# EAGLE design PulsePal_3_0_1 (EAGLE 9.7.0)
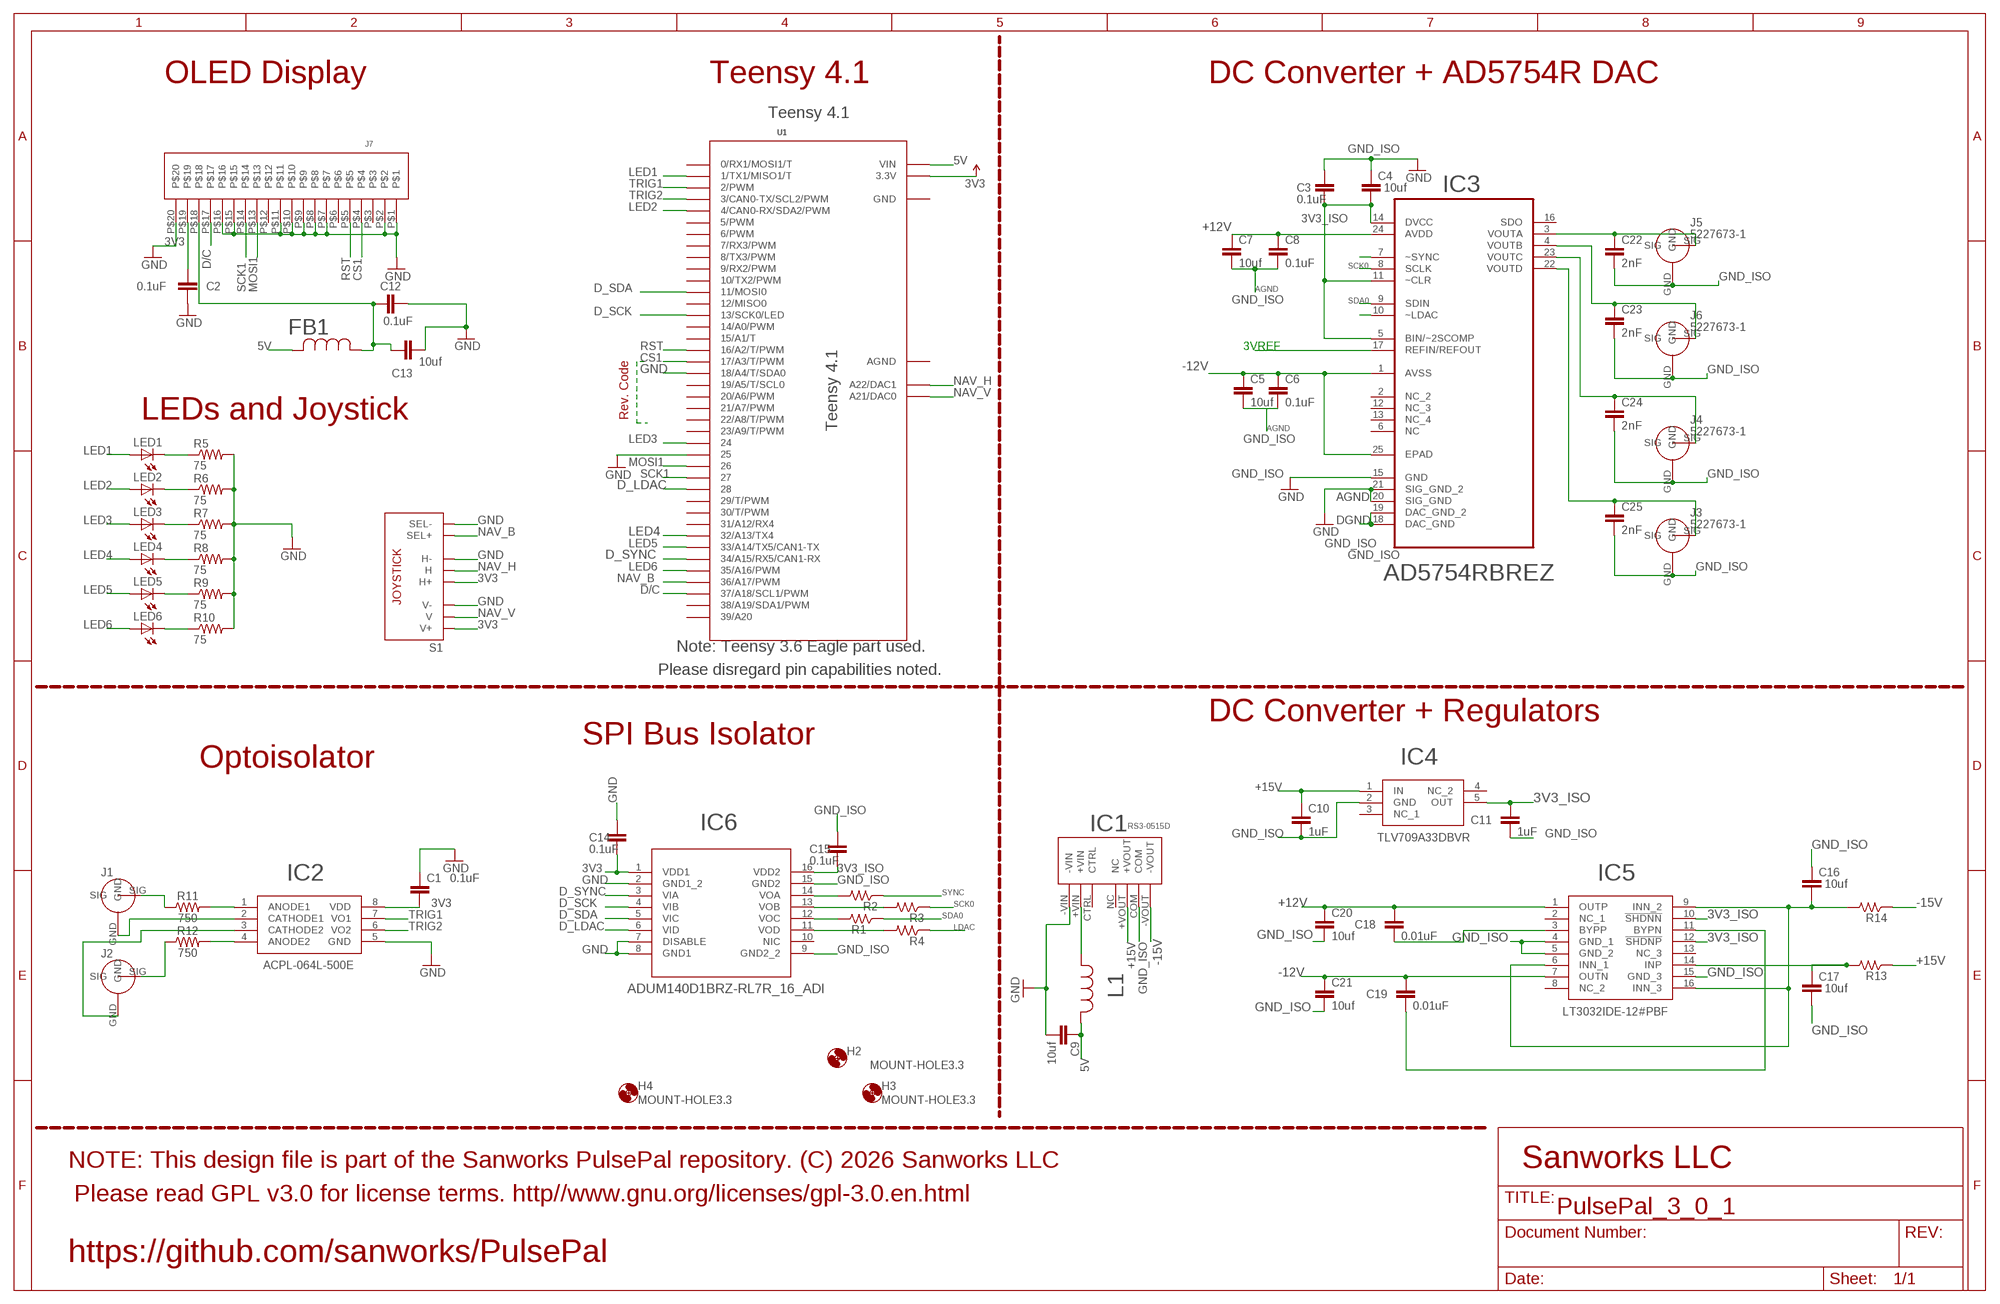
[diagram p0: schematic, sheet 1]

## Parts
C1  0.1uF  1.0UF-0805-25V-10%  [0805]
C2  0.1uF  1.0UF-0805-25V-10%  [0805]
C3  0.1uF  1.0UF-0805-25V-10%  [0805]
C4  10uf  CAP1206  [1206@1]
C5  10uf  CAP1206  [1206@1]
C6  0.1uF  1.0UF-0805-25V-10%  [0805]
C7  10uf  CAP1206  [1206@1]
C8  0.1uF  1.0UF-0805-25V-10%  [0805]
C9  10uf  CAP1206  [1206@1]
C10  1uF  1.0UF-0805-25V-10%  [0805]
C11  1uF  1.0UF-0805-25V-10%  [0805]
C12  0.1uF  1.0UF-0805-25V-10%  [0805]
C13  10uf  CAP1206  [1206@1]
C14  0.1uF  1.0UF-0805-25V-10%  [0805]
C15  0.1uF  1.0UF-0805-25V-10%  [0805]
C16  10uf  CAP1206  [1206@1]
C17  10uf  CAP1206  [1206@1]
C18  0.01uF  1.0UF-0805-25V-10%  [0805]
C19  0.01uF  1.0UF-0805-25V-10%  [0805]
C20  10uf  CAP1206  [1206@1]
C21  10uf  CAP1206  [1206@1]
C22  2nF  1.0UF-0805-25V-10%  [0805]
C23  2nF  1.0UF-0805-25V-10%  [0805]
C24  2nF  1.0UF-0805-25V-10%  [0805]
C25  2nF  1.0UF-0805-25V-10%  [0805]
FB1  MPZ2012S221AT000IND_2012_TDK  [IND_2012_TDK]
H2  MOUNT-HOLE3.3  [3,3]
H3  MOUNT-HOLE3.3  [3,3]
H4  MOUNT-HOLE3.3  [3,3]
IC1  RS3-0515D  [RS3-0515D]
IC2  ACPL-064L-500E  [SOIC127P599X330-8N]
IC3  AD5754RBREZ  [SOP65P640X120-25N]
IC4  TLV709A33DBVR  [SOT95P280X145-5N]
IC5  LT3032IDE-12#PBF  [LT3032IDE12PBF]
IC6  ADUM140D1BRZ-RL7R_16_ADI  [R_16_ADI]
J1  5227673-1  [52276731]
J2  5227673-1  [52276731]
J3  5227673-1  [52276731]
J4  5227673-1  [52276731]
J5  5227673-1  [52276731]
J6  5227673-1  [52276731]
J7  NHD-2.7-12864WDW3  [NHD-2.7-12864WDW3]
L1  RLS-397IND_LS-397_RCP  [IND_LS-397_RCP]
LED1  LEDCHIPLED_1206  [CHIPLED_1206]
LED2  LEDCHIPLED_1206  [CHIPLED_1206]
LED3  LEDCHIPLED_1206  [CHIPLED_1206]
LED4  LEDCHIPLED_1206  [CHIPLED_1206]
LED5  LEDCHIPLED_1206  [CHIPLED_1206]
LED6  LEDCHIPLED_1206  [CHIPLED_1206]
R1  22  R-US_CHIP-0805(2012-METRIC)  [RESC2012X65]
R2  22  R-US_CHIP-0805(2012-METRIC)  [RESC2012X65]
R3  22  R-US_CHIP-0805(2012-METRIC)  [RESC2012X65]
R4  22  R-US_CHIP-0805(2012-METRIC)  [RESC2012X65]
R5  75  RESISTOR1206  [1206]
R6  75  RESISTOR1206  [1206]
R7  75  RESISTOR1206  [1206]
R8  75  RESISTOR1206  [1206]
R9  75  RESISTOR1206  [1206]
R10  75  RESISTOR1206  [1206]
R11  750  10OHM-1206-1/4W-1%  [1206]
R12  750  10OHM-1206-1/4W-1%  [1206]
R13  22  R-US_CHIP-0805(2012-METRIC)  [RESC2012X65]
R14  22  R-US_CHIP-0805(2012-METRIC)  [RESC2012X65]
S1  JOYSTICKPTH  [JOYSTICK]
U1  TEENSY_3.6_DIL  [TEENSY_3.6_DIL]

## Nets
3V3: C1.2 C2.1 C14.2 IC2.8(VDD) IC6.1(VDD1) J7.P$19 S1.H1(H+) S1.V1(V+) U1.3.3V U1.3.3V3(3.3V) ; supply symbol labelled VCC
3V3_ISO: C3.2 C4.2 C11.1 C15.2 IC3.5(BIN/~2SCOMP) IC3.11(~CLR) IC3.14(DVCC) IC4.5(OUT) IC5.10(!SHDNN) IC5.12(!SHDNP) IC6.16(VDD2)
3VREF: IC3.17(REFIN/REFOUT)
5V: C9.1 FB1.2 L1.1 U1.VIN
+12V: C7.1 C8.1 C18.1 C20.1 IC3.24(AVDD) IC5.1(OUTP)
+15V: C10.1 IC1.+VOUT IC4.1(IN) R13.1
-12V: C5.1 C6.1 C19.1 C21.1 IC3.1(AVSS) IC3.25(EPAD) IC5.7(OUTN)
-15V: IC1.-VOUT R14.1
CS1: J7.P$4 U1.17/A3(17/A3/T/PWM)
D/C: J7.P$17 U1.37/A18(37/A18/SCL1/PWM)
D_LDAC: IC6.6(VID) U1.28
D_SCK: IC6.4(VIB) U1.13(13/SCK0/LED)
D_SDA: IC6.5(VIC) U1.11(11/MOSI0)
D_SYNC: IC6.3(VIA) U1.34/A15(34/A15/RX5/CAN1-RX)
GND: C1.1 C2.2 C9.2 C12.2 C13.2 C14.1 IC1.-VIN IC2.5(GND) IC6.2(GND1_2) IC6.7(DISABLE) IC6.8(GND1) J7.P$1 J7.P$2 J7.P$7 J7.P$8 J7.P$9 J7.P$10 J7.P$11 J7.P$15 J7.P$16 J7.P$20 R5.2 R6.2 R7.2 R8.2 R9.2 R10.2 S1.B2A(SEL-) S1.H3(H-) S1.V3(V-) U1.18/A4(18/A4/T/SDA0) U1.25
GND_ISO: C3.1 C4.1 C5.2 C6.2 C7.2 C8.2 C10.2 C11.2 C15.1 C16.1 C17.2 C20.2 C21.2 C22.2 C23.2 C24.2 C25.2 IC1.COM IC3.15(GND) IC3.18(DAC_GND) IC3.19(DAC_GND_2) IC3.20(SIG_GND) IC3.21(SIG_GND_2) IC4.2(GND) IC5.4(GND_1) IC5.5(GND_2) IC5.15(GND_3) IC6.9(GND2_2) IC6.15(GND2) J3.GND J4.GND J5.GND J6.GND ; supply symbol labelled GND
LDAC: IC3.10(~LDAC) R4.1
LED1: LED1.A U1.1(1/TX1/MISO1/T)
LED2: LED2.A U1.4(4/CAN0-RX/SDA2/PWM)
LED3: LED3.A U1.24
LED4: LED4.A U1.32/A13(32/A13/TX4)
LED5: LED5.A U1.33/A14(33/A14/TX5/CAN1-TX)
LED6: LED6.A U1.35/A16(35/A16/PWM)
MOSI1: J7.P$13 U1.26
N$1: IC2.1(ANODE1) R11.2
N$2: J1.SIG R11.1
N$3: IC2.4(ANODE2) R12.2
N$4: J2.SIG R12.1
N$5: IC2.2(CATHODE1) J1.GND
N$6: IC2.3(CATHODE2) J2.GND
N$7: LED1.C R5.1
N$8: LED2.C R6.1
N$9: C22.1 IC3.3(VOUTA) J5.SIG
N$10: C23.1 IC3.4(VOUTB) J6.SIG
N$11: C24.1 IC3.23(VOUTC) J4.SIG
N$12: C25.1 IC3.22(VOUTD) J3.SIG
N$13: IC6.14(VOA) R2.2
N$14: IC6.13(VOB) R3.2
N$15: IC1.+VIN L1.2
N$16: C16.2 IC5.6(INN_1) IC5.9(INN_2) IC5.16(INN_3) R14.2
N$17: IC6.12(VOC) R1.2
N$18: IC6.11(VOD) R4.2
N$19: LED3.C R7.1
N$20: LED4.C R8.1
N$21: LED5.C R9.1
N$22: LED6.C R10.1
N$23: C17.1 IC5.14(INP) R13.2
N$24: C18.2 IC5.3(BYPP)
N$25: C12.1 C13.1 FB1.1 J7.P$18
N$26: C19.2 IC5.11(BYPN)
NAV_B: S1.B1A(SEL+) U1.36/A17(36/A17/PWM)
NAV_H: S1.H2(H) U1.A22(A22/DAC1)
NAV_V: S1.V2(V) U1.A21(A21/DAC0)
RST: J7.P$5 U1.16/A2(16/A2/T/PWM)
SCK0: IC3.8(SCLK) R3.1
SCK1: J7.P$14 U1.27
SDA0: IC3.9(SDIN) R1.1
SYNC: IC3.7(~SYNC) R2.1
TRIG1: IC2.7(VO1) U1.2(2/PWM)
TRIG2: IC2.6(VO2) U1.3(3/CAN0-TX/SCL2/PWM)
Unconnected: IC1.CTRL IC1.NC IC3.2(NC_2) IC3.6(NC) IC3.12(NC_3) IC3.13(NC_4) IC3.16(SDO) IC4.3(NC_1) IC4.4(NC_2) IC5.2(NC_1) IC5.8(NC_2) IC5.13(NC_3) IC6.10(NIC) J7.P$3 J7.P$6 J7.P$12 U1.0(0/RX1/MOSI1/T) U1.5(5/PWM) U1.6(6/PWM) U1.7(7/RX3/PWM) U1.8(8/TX3/PWM) U1.9(9/RX2/PWM) U1.10(10/TX2/PWM) U1.12(12/MISO0) U1.14/A0(14/A0/PWM) U1.15/A1(15/A1/T) U1.19/A5(19/A5/T/SCL0) U1.20/A6(20/A6/PWM) U1.21/A7(21/A7/PWM) U1.22/A8(22/A8/T/PWM) U1.23/A9(23/A9/T/PWM) U1.29(29/T/PWM) U1.30(30/T/PWM) U1.31/A12(31/A12/RX4) U1.38/A19(38/A19/SDA1/PWM) U1.39/A20

## Notes on the sheet
- OLED Display | Teensy 4.1 | DC Converter + AD5754R DAC
- Teensy 4.1
- SCK0
- AGND
- SDA0
- 3VREF
- LEDs and Joystick | Rev. Code
- Teensy 4.1 | AGND
- AGND
- DGND
- Note: Teensy 3.6 Eagle part used.
- Please disregard pin capabilities noted.
- DC Converter + Regulators
- SPI Bus Isolator
- Optoisolator
- SYNC
- SCK0
- SDA0
- LDAC
- NOTE: This design file is part of the Sanworks PulsePal repository. (C) 2026 Sanworks LLC | Sanworks LLC
- Please read GPL v3.0 for license terms. http//www.gnu.org/licenses/gpl-3.0.en.html
- https://github.com/sanworks/PulsePal

## Power pins joined to a net without a drawn wire
GND: U1.GND U1.GND1(GND)
GND_ISO: U1.AGND

## Library data of the parts
C1-C3 C6 C8 C10-C12 C14 C15 C18 C19 C22-C25 = SparkFun-Capacitors:1.0UF: 1µF ceramic capacitors A capacitor is a passive two-terminal electrical component used to store electrical energy temporarily in an electric field.; PROD_ID: CAP-08064; VALUE: 1.0uF
C4 C5 C7 C9 C13 C16 C17 C20 C21 = SparkFun-Capacitors:CAP: Capacitor Standard 0603 ceramic capacitor, and 0.1" leaded capacitor.
FB1 = MPZ2012S221AT000:MPZ2012S221AT000; COPYRIGHT: Copyright (C) 2026 Ultra Librarian. All rights reserved.; MANUFACTURER_NAME: TDK; MANUFACTURER_PART_NUMBER: MPZ2012S221AT000
H2-H4 = holes:MOUNT-HOLE: MOUNTING HOLE with drill center marker
IC1 = JoshParts10:RS3-0515D
IC2 = ACPL-064L-500E:ACPL-064L-500E: BROADCOM LIMITED - ACPL-064L-500E - Optocoupler, Digital Output, 2 Channel, 3.75 kV, 10 Mbaud, SOIC, 8 Pins Source: Datasheet <https://componentsearchengine.com/Datasheets/2/ACPL-064L-500E.pdf>; DESCRIPTION: BROADCOM LIMITED - ACPL-064L-500E - Optocoupler, Digital Output, 2 Channel, 3.75 kV, 10 Mbaud, SOIC, 8 Pins; HEIGHT: 3.302mm; MANUFACTURER_NAME: Avago Technologies; MANUFACTURER_PART_NUMBER: ACPL-064L-500E; MOUSER_PART_NUMBER: 630-ACPL-064L-500E; MOUSER_PRICE-STOCK: https://www.mouser.co.uk/ProductDetail/Broadcom-Avago/ACPL-064L-500E?qs=zXUFZjqEZijW%2FjwN8Fr74w%3D%3D
IC3 = Analog Devices_By_element14_Batch_1:AD5754RBREZ: DAC; MPN: AD5754RBREZ; OC_FARNELL: 1786050; OC_NEWARK: 51P3755; PACKAGE: TSSOP-24; SUPPLIER: Analog Devices
IC4 = TLV709A33DBVR:TLV709A33DBVR: LDO Voltage Regulators 150-mA 30-V low-dropout (LDO) linear regulator with 3.2- A supply current Source: Datasheet <https://www.ti.com/general/docs/suppproductinfo.tsp?distId=26&gotoUrl=https://www.ti.com/lit/gpn/tlv709>; DESCRIPTION: LDO Voltage Regulators 150-mA 30-V low-dropout (LDO) linear regulator with 3.2- A supply current; HEIGHT: 1.45mm; MANUFACTURER_NAME: Texas Instruments; MANUFACTURER_PART_NUMBER: TLV709A33DBVR; MOUSER_PART_NUMBER: 595-TLV709A33DBVR; MOUSER_PRICE-STOCK: https://www.mouser.co.uk/ProductDetail/Texas-Instruments/TLV709A33DBVR?qs=ulEaXIWI0c9FFgY5oYNXpQ%3D%3D
IC5 = LT3032IDE-12#PBF:LT3032IDE-12#PBF: LDO Voltage Regulators Dual 200mA Positive/Negative, Low Noise, Low Dropout Linear Regulator Source: Datasheet <https://www.analog.com/media/en/technical-documentation/data-sheets/3032ff.pdf>; DESCRIPTION: LDO Voltage Regulators Dual 200mA Positive/Negative, Low Noise, Low Dropout Linear Regulator; HEIGHT: 0.8mm; MANUFACTURER_NAME: Analog Devices; MANUFACTURER_PART_NUMBER: LT3032IDE-12#PBF; MOUSER_PART_NUMBER: 584-LT3032IDE-12#PBF; MOUSER_PRICE-STOCK: https://www.mouser.co.uk/ProductDetail/Analog-Devices/LT3032IDE-12PBF?qs=ytflclh7QUXD%252BGFWQbW3lA%3D%3D
IC6 = ADUM140D1BRZ:ADUM140D1BRZ-RL7; COPYRIGHT: Copyright (C) 2026 Ultra Librarian. All rights reserved.; DATASHEET: https://www.analog.com/media/en/technical-documentation/data-sheets/ADuM140D_140E_141D_141E_142D_142E.pdf; DESCRIPTION: Robust, Quad Channel Isolator W/ Input Disable & 0 Reverse Channels; MANUFACTURER_NAME: Analog Devices Inc; MANUFACTURER_PART_NUMBER: ADUM140D1BRZ-RL7
J1-J6 = 5227673-1:5227673-1: Body Features: Body Plating Material Nickel | Body Material Zinc | Configuration Features: PCB Mount Orientation Vertical | Number of Positions 1 | Number of Coaxial Contacts 1 | Contact Features: RF Connector Center Contact Plating Material Gold | RF Connector Center Contact Material Phosphor Bronze | RF Connector Center Contact Plating Thickness 889 MICIN | RF Connector Center Contact Underplating Material Nickel | Dimensions: Mounting Post Length 3.48 MM | Mounting Post Length .137 INCH | Profile Height Source: Datasheet <https://www.te.com/commerce/DocumentDelivery/DDEController?Action=srchrtrv&DocNm=1307191_BNC_Connectors&DocType=Catalog Section&DocLang=English&PartCntxt=5227673-1&DocFormat=pdf>; DESCRIPTION: Body Features: Body Plating Material Nickel | Body Material Zinc | Configuration Features: PCB Mount Orientation Vertical | Number of Positions 1 | Number of Coaxial Contacts 1 | Contact Features: RF Connector Center Contact Plating Material Gold | RF Connector Center Contact Material Phosphor Bronze | RF Connector Center Contact Plating Thickness 889 MICIN | RF Connector Center Contact Underplating Material Nickel | Dimensions: Mounting Post Length 3.48 MM | Mounting Post Length .137 INCH | Profile Height; HEIGHT: 34mm; MANUFACTURER_NAME: TE Connectivity; MANUFACTURER_PART_NUMBER: 5227673-1; MOUSER_PART_NUMBER: 571-5227673-1; MOUSER_PRICE-STOCK: https://www.mouser.co.uk/ProductDetail/TE-Connectivity/5227673-1?qs=GSeC4G%252BEqEWRusayo0jRGQ%3D%3D
J7 = JoshParts10:NHD-2.7-12864WDW3
L1 = RLS_397:RLS-397; COPYRIGHT: Copyright (C) 2026 Ultra Librarian. All rights reserved.; MANUFACTURER_NAME: Recom Power; MANUFACTURER_PART_NUMBER: RLS-397
LED1-LED6 = led:LED: LED OSRAM: - CHIPLED LG R971, LG N971, LY N971, LG Q971, LY Q971, LO R971, LY R971 LH N974, LH R974 LS Q976, LO Q976, LY Q976 LO Q996 - Hyper CHIPLED LW Q18S LB Q993, LB Q99A, LB R99A - SideLED LS A670, LO A670, LY A670, LG A670, LP A670 LB A673, LV A673, LT A673, LW A673 LH A674 LY A675 LS A676, LA A676, LO A676, LY A676, LW A676 LS A679, LY A679, LG A679 - Hyper Micro SIDELED® LS Y876, LA Y876, LO Y876, LY Y876 LT Y87S - SmartLED LW L88C, LW L88S LB L89C, LB L89S, LG L890 LS L89K, LO L89K, LY L89K LS L896, LA L896, LO L896, LY L896 - TOPLED LS T670, LO T670, LY T670, LG T670, LP T670 LSG T670, LSP T670, LSY T670, LOP T670, LYG T670 LG T671, LOG T671, LSG T671 LB T673, LV T673, LT T673, LW T673 LH T674 LS T676, LA T676, LO T676, LY T676, LB T676, LH T676, LSB T676, LW T676 LB T67C, LV T67C, LT T67C, LS T67K, LO T67K, LY T67K, LW E67C LS E67B, LA E67B, LO E67B, LY E67B, LB E67C, LV E67C, LT E67C LW T67C LS T679, LY T679, LG T679 LS T770, LO T770, LY T770, LG T770, LP T770 LB T773, LV T773, LT T773, LW T773 LH T774 LS E675, LA E675, LY E675, LS T675 LS T776, LA T776, LO T776, LY T776, LB T776 LHGB T686 LT T68C, LB T68C - Hyper Mini TOPLED® LB M676 - Mini TOPLED Santana® LG M470 LS M47K, LO M47K, LY M47K Source: http://www.osram.convergy.de LUXEON: - LUMILED® LXK2-PW12-R00, LXK2-PW12-S00, LXK2-PW14-U00, LXK2-PW14-V00 LXK2-PM12-R00, LXK2-PM12-S00, LXK2-PM14-U00 LXK2-PE12-Q00, LXK2-PE12-R00, LXK2-PE12-S00, LXK2-PE14-T00, LXK2-PE14-U00 LXK2-PB12-K00, LXK2-PB12-L00, LXK2-PB12-M00, LXK2-PB14-N00, LXK2-PB14-P00, LXK2-PB14-Q00 LXK2-PR12-L00, LXK2-PR12-M00, LXK2-PR14-Q00, LXK2-PR14-R00 LXK2-PD12-Q00, LXK2-PD12-R00, LXK2-PD12-S00 LXK2-PH12-R00, LXK2-PH12-S00 LXK2-PL12-P00, LXK2-PL12-Q00, LXK2-PL12-R00 Source: www.luxeon.com KINGBRIGHT: KA-3528ASYC Source: www.kingbright.com
R1-R4 R13 R14 = Resistor:R-US: Resistor Fixed - ANSI; CATEGORY_L1: Resistors; DESCRIPTION: Chip Resistor 2.00 X 1.25 X 0.65 mm body 0805(2012-METRIC) Package; PACKAGE: Surface Mount; PACKAGE_SIZE: 0805
R5-R10 = SparkFun:RESISTOR: Resistor Basic schematic elements and footprints for 0603, 1206, and PTH resistors.
R11 R12 = SparkFun-Resistors:10OHM: 10Ω resistor A resistor is a passive two-terminal electrical component that implements electrical resistance as a circuit element. Resistors act to reduce current flow, and, at the same time, act to lower voltage levels within circuits. - Wikipedia; PROD_ID: RES-08705; VALUE: 10
S1 = SparkFun:JOYSTICK: Thumb Joystick Joystick commonly found in PS2 controllers. Two pots and a select switch. Footprint proven. Spark Fun Electronics SKU : COM-09032
U1 = Teensy_3_and_LC_Series_Boards_v1.4:TEENSY_3.6_DIL: Teensy 3.6 DIL Package

## Net classes
0 default: width 0.203 mm

## Board
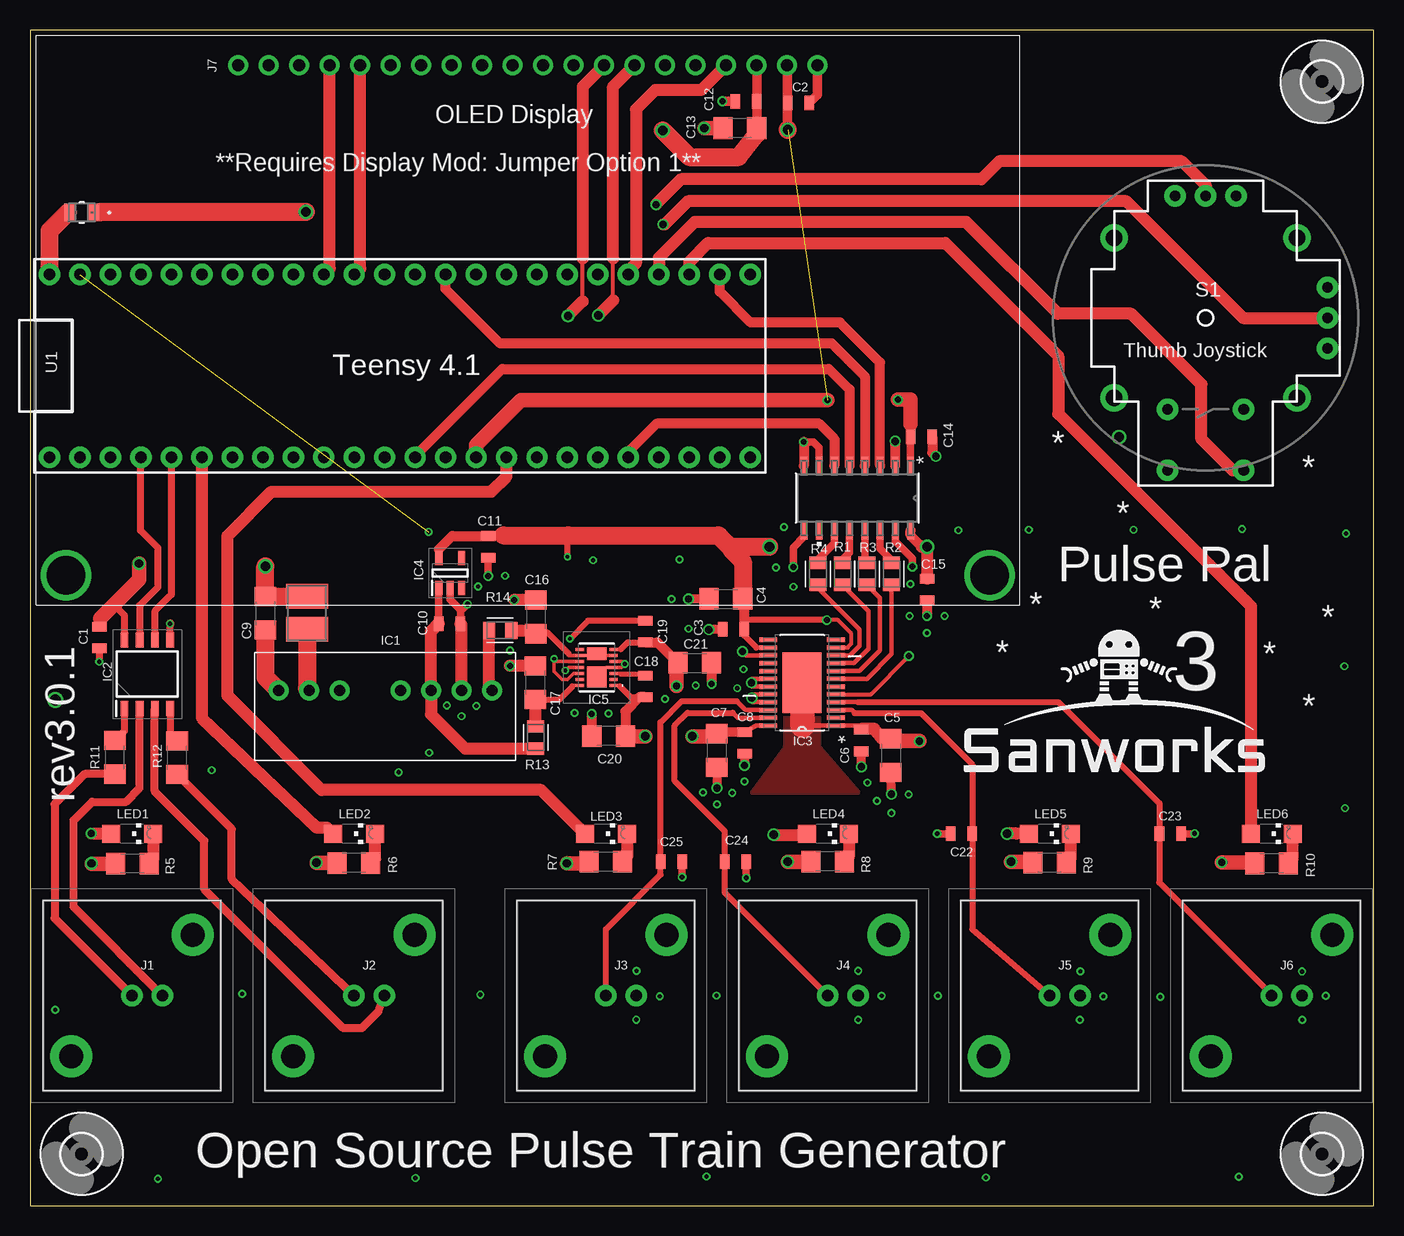
[diagram p1: board, top side]
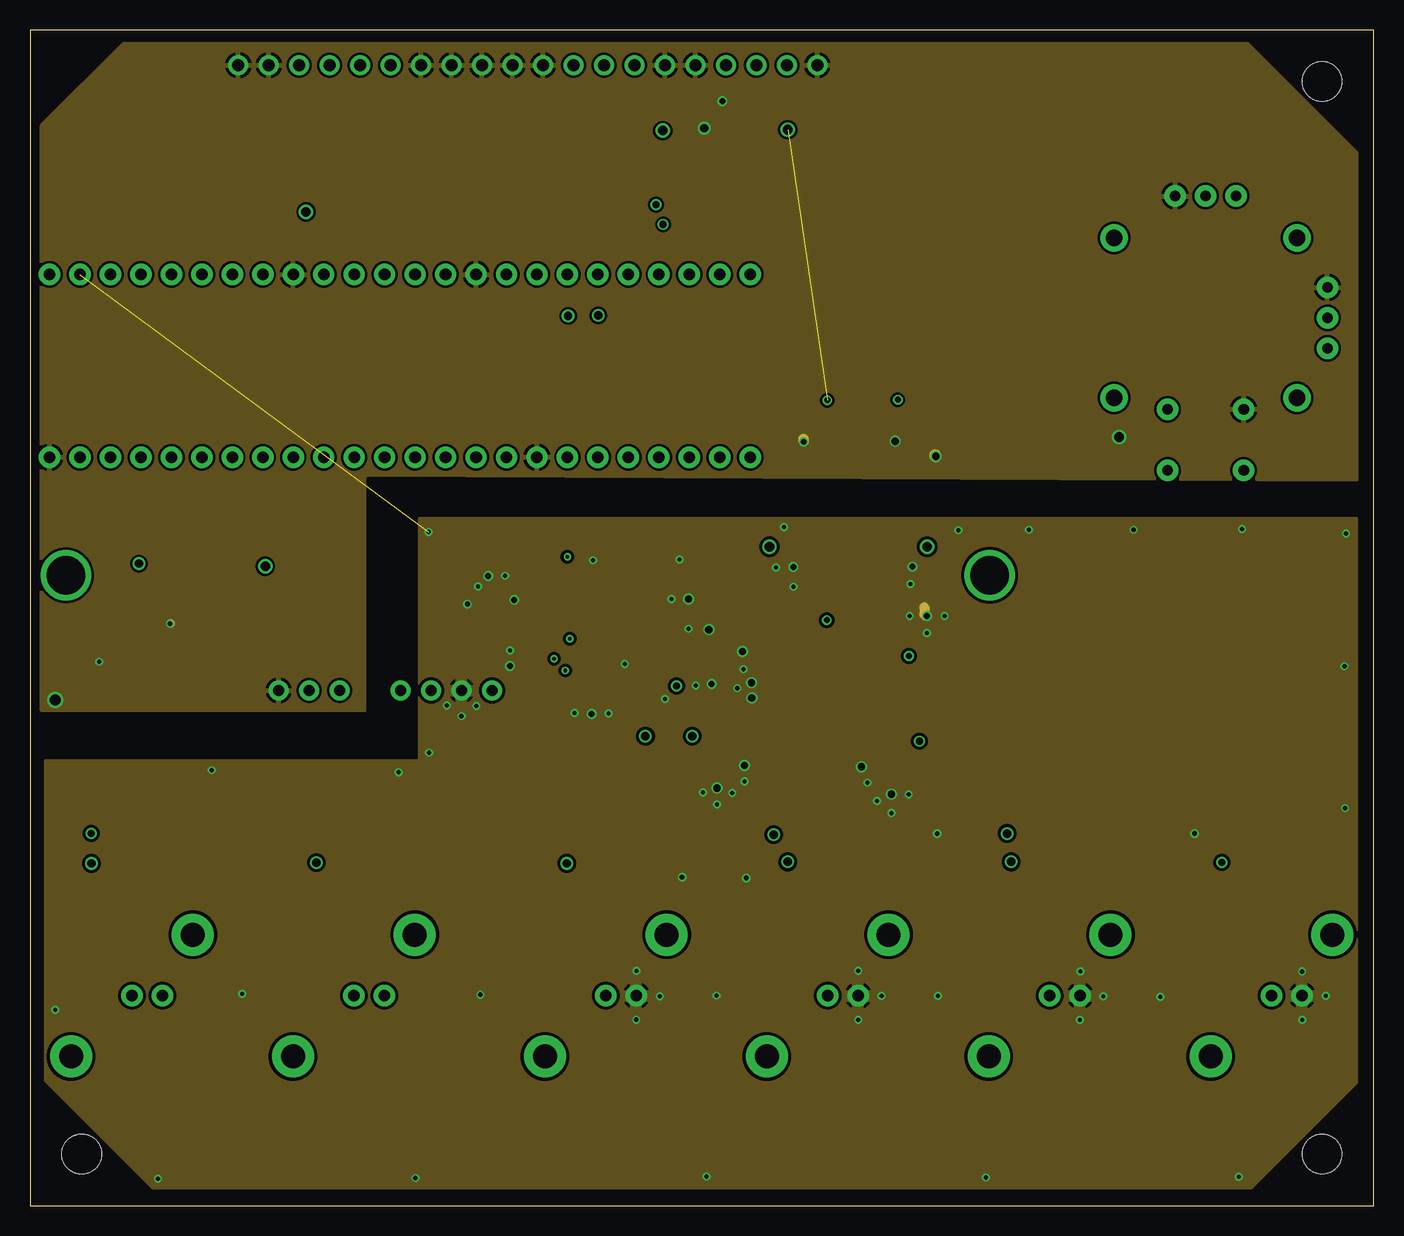
[diagram p2: board, inner layer Route2]
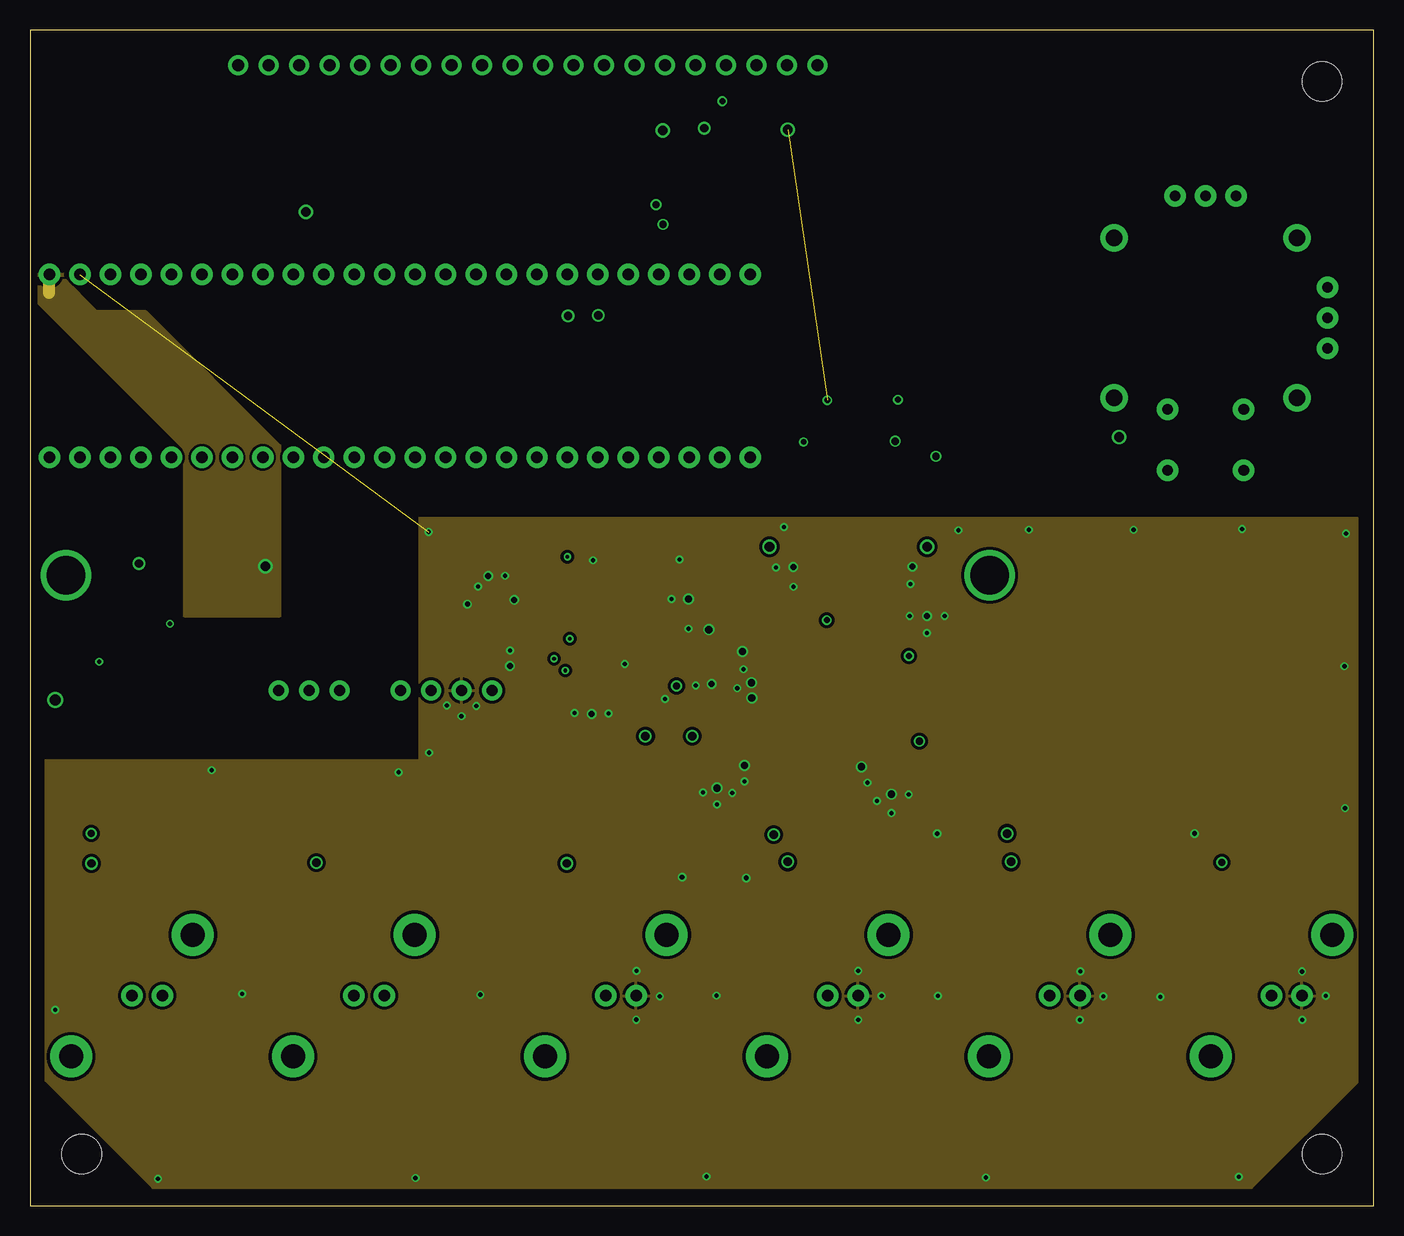
[diagram p3: board, inner layer Route15]
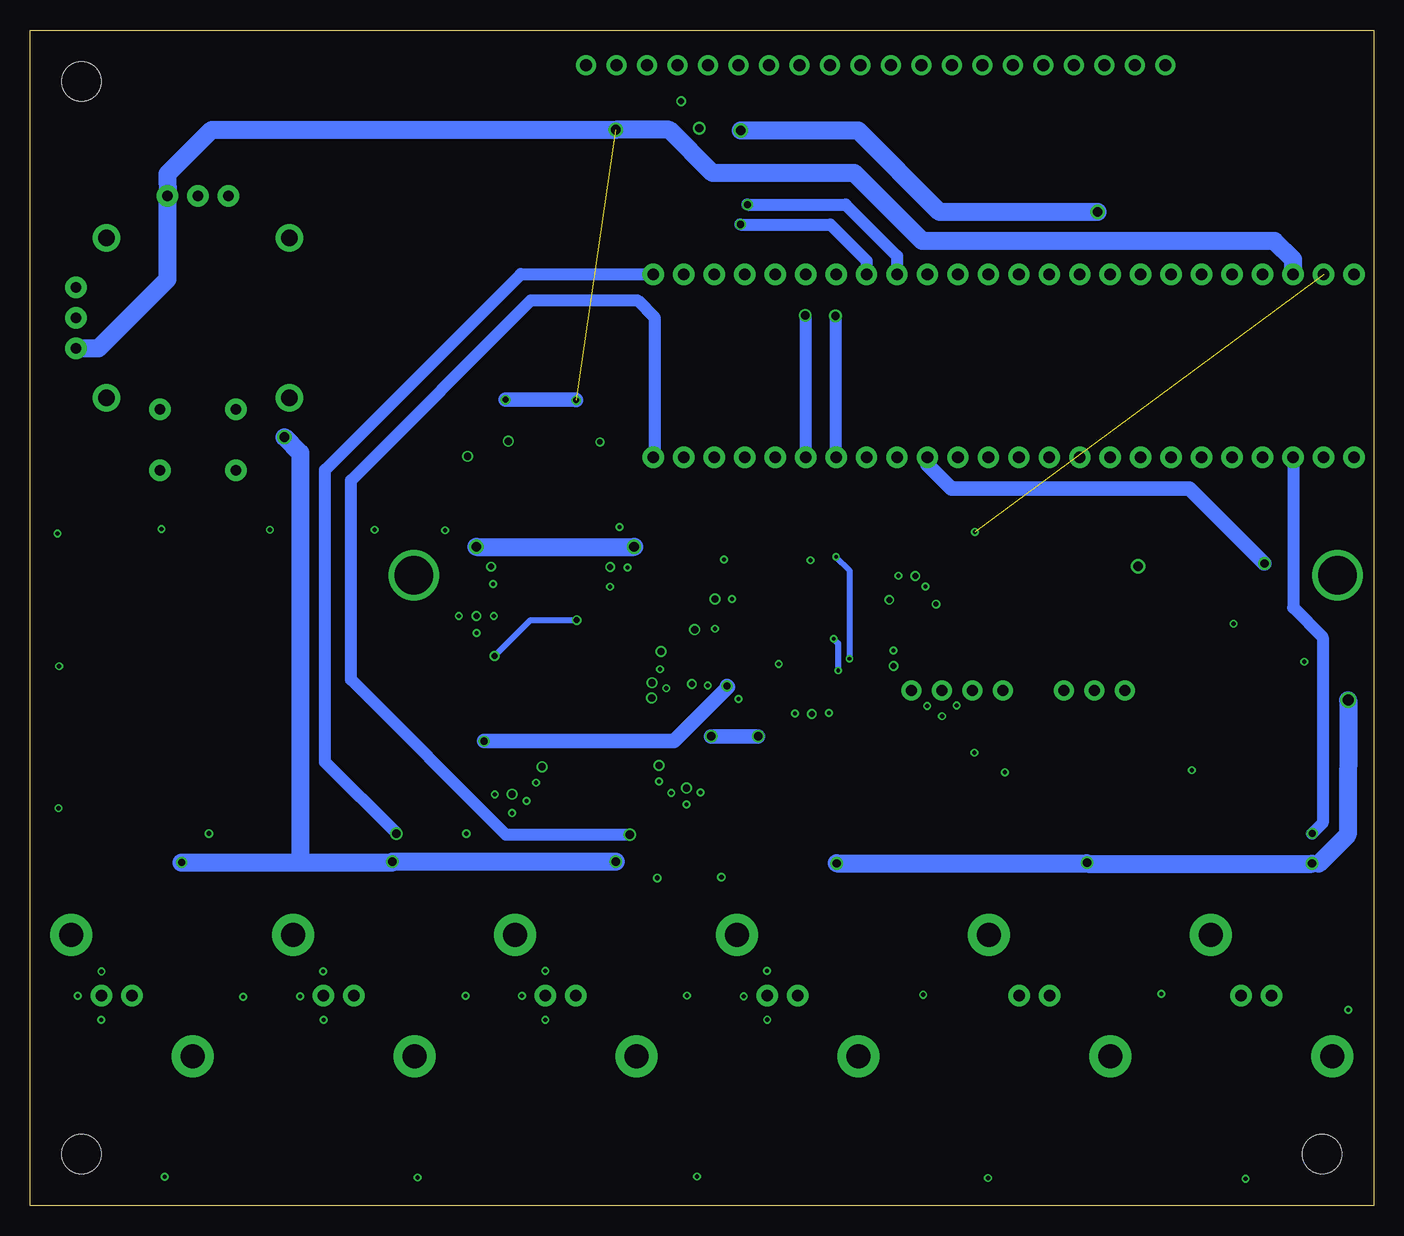
[diagram p4: board, bottom side, seen from below]

Size 112 x 98 mm. Coordinates in mm from the lower left corner, seen from the top.
Outline: 112,98 0,98 0,0 112,0 112,98
Copper layers (1+2*15+16): Top 0.035mm / dielectric 1.5mm / Route2 0.0175mm / dielectric 1.1mm / Route15 0.0175mm / dielectric 0.2mm / Bottom 0.035mm
Design rules "SeeedStudio_2layer_DRU_no_angle_20140221 *": minimum track width 6mil, minimum drill 12mil, track to track 8mil, track to pad 8mil, pad to pad 8mil, via to via 8mil, smd to smd 0mil, copper to edge 10mil, drill to drill 10mil, minimum pad ring 10mil, minimum via ring 6mil, stop-mask expansion 2mil, vias tented up to drill 100mil, thermal gap 10mil

### Footprints (pad centres in the part's own frame; a part is rotated, then mirrored left to right if it is on the bottom)
0805 = smd 0.8 x 1.2: 1 -0.9,0; 2 0.9,0
1206@1 = smd 1.6 x 1.8: 1 -1.4,0; 2 1.4,0
IND_2012_TDK = smd 0.956 x 1.45: 1 -0.978,0; 2 0.978,0
3,3 = hole 3.3: 0,0
RS3-0515D = drill 0.9 pad 1.676: +VIN 7.62,5.08; +VOUT 17.78,5.08; -VIN 5.08,5.08; -VOUT 22.86,5.08; COM 20.32,5.08; CTRL 10.16,5.08; NC 15.24,5.08
SOIC127P599X330-8N = smd 1.25 x 0.65: 1 -2.85,1.905; 2 -2.85,0.635; 3 -2.85,-0.635; 4 -2.85,-1.905; 5 2.85,-1.905; 6 2.85,-0.635; 7 2.85,0.635; 8 2.85,1.905
SOP65P640X120-25N = smd 1.473 x 0.356: 1 -2.819,3.581; 2 -2.819,2.921; 3 -2.819,2.286; 4 -2.819,1.626; 5 -2.819,0.965; 6 -2.819,0.33; 7 -2.819,-0.33; 8 -2.819,-0.965; 9 -2.819,-1.626; 10 -2.819,-2.286; 11 -2.819,-2.921; 12 -2.819,-3.581; 13 2.819,-3.581; 14 2.819,-2.921; 15 2.819,-2.286; 16 2.819,-1.626; 17 2.819,-0.965; 18 2.819,-0.33; 19 2.819,0.33; 20 2.819,0.965; 21 2.819,1.626; 22 2.819,2.286; 23 2.819,2.921; 24 2.819,3.581 | smd 3.251 x 5.029: 25 0,0
SOT95P280X145-5N = smd 1.2 x 0.6: 1 -1.25,0.95; 2 -1.25,0; 3 -1.25,-0.95; 4 1.25,-0.95; 5 1.25,0.95
LT3032IDE12PBF = smd 0.25 x 0.7: 1 -1.5,-1.4; 2 -1,-1.4; 3 -0.5,-1.4; 5 0.5,-1.4; 6 1,-1.4; 7 1.5,-1.4; 8 1.5,1.4; 10 0.5,1.4; 11 0,1.4; 12 -0.5,1.4; 13 -1,1.4; 14 -1.5,1.4 | smd 0.25 x 0.925: 4 0,-1.287; 9 1,1.287 | smd 1.78 x 1.65: 15 -0.79,0 | smd 1.07 x 1.65: 16 1.145,0
R_16_ADI = smd 1.506 x 0.561: 1 -2.703,4.445; 2 -2.703,3.175; 3 -2.703,1.905; 4 -2.703,0.635; 5 -2.703,-0.635; 6 -2.703,-1.905; 7 -2.703,-3.175; 8 -2.703,-4.445; 9 2.703,-4.445; 10 2.703,-3.175; 11 2.703,-1.905; 12 2.703,-0.635; 13 2.703,0.635; 14 2.703,1.905; 15 2.703,3.175; 16 2.703,4.445
52276731 = drill 0.97 pad 1.778: GND 2.54,0; SIG 0,0 | drill 2 pad 3.5: POST1 -5.08,-5.08; POST2 5.08,5.08
NHD-2.7-12864WDW3 = drill 3.2 pad 4: HOLE1 2.5,2.5; HOLE2 79.5,2.5 | drill 1 pad 1.676: P$1 16.87,45; P$2 19.41,45; P$3 21.95,45; P$4 24.49,45; P$5 27.03,45; P$6 29.57,45; P$7 32.11,45; P$8 34.65,45; P$9 37.19,45; P$10 39.73,45; P$11 42.27,45; P$12 44.81,45; P$13 47.35,45; P$14 49.89,45; P$15 52.43,45; P$16 54.97,45; P$17 57.51,45; P$18 60.05,45; P$19 62.59,45; P$20 65.13,45
IND_LS-397_RCP = smd 2.045 x 3.505: 1 -1.378,0; 2 1.378,0
CHIPLED_1206 = smd 1.5 x 1.5: A 0,-1.75; C 0,1.75
RESC2012X65 = smd 1.031 x 1.42: 1 -0.919,0; 2 0.919,0
1206 = smd 1.6 x 1.8: 1 -1.4,0; 2 1.4,0
JOYSTICK = drill 0.9 pad 1.778: B1A -3.175,12.7; B1B 3.175,12.7; B2A -3.175,7.62; B2B 3.175,7.62 | drill 0.889 pad 1.778: H1 -2.54,-10.16; H2 0,-10.16; H3 2.54,-10.16; V1 -10.16,2.54; V2 -10.16,0; V3 -10.16,-2.54 | drill 1.397 pad 2.286: MOUNT1 -7.62,6.668; MOUNT2 -7.62,-6.668; MOUNT3 7.62,-6.668; MOUNT4 7.62,6.668
TEENSY_3.6_DIL = drill 0.965 pad 1.778: 0 -7.62,25.4; 1 -7.62,22.86; 2 -7.62,20.32; 3 -7.62,17.78; 3.3V 7.62,22.86; 3.3V3 -7.62,-7.62; 4 -7.62,15.24; 5 -7.62,12.7; 6 -7.62,10.16; 7 -7.62,7.62; 8 -7.62,5.08; 9 -7.62,2.54; 10 -7.62,0; 11 -7.62,-2.54; 12 -7.62,-5.08; 13 7.62,-5.08; 14/A0 7.62,-2.54; 15/A1 7.62,0; 16/A2 7.62,2.54; 17/A3 7.62,5.08; 18/A4 7.62,7.62; 19/A5 7.62,10.16; 20/A6 7.62,12.7; 21/A7 7.62,15.24; 22/A8 7.62,17.78; 23/A9 7.62,20.32; 24 -7.62,-10.16; 25 -7.62,-12.7; 26 -7.62,-15.24; 27 -7.62,-17.78; 28 -7.62,-20.32; 29 -7.62,-22.86; 30 -7.62,-25.4; 31/A12 -7.62,-27.94; 32/A13 -7.62,-30.48; 33/A14 7.62,-30.48; 34/A15 7.62,-27.94; 35/A16 7.62,-25.4; 36/A17 7.62,-22.86; 37/A18 7.62,-20.32; 38/A19 7.62,-17.78; 39/A20 7.62,-15.24; A21 7.62,-12.7; A22 7.62,-10.16; AGND 7.62,25.4; GND -7.62,27.94; GND1 7.62,-7.62; VIN 7.62,27.94

### Placement (x,y rotation side)
C1  5.79,47.35 90 top
C2  64.06,91.92 0 top
C3  58.65,48.03 0 top
C4  58.01,50.57 0 top
C5  71.76,37.51 270 top
C6  69.29,38.75 270 top
C7  57.24,37.93 270 top
C8  59.58,38.56 270 top
C9  19.61,49.38 270 top
C10  34.98,48.51 0 top
C11  38.2,54.91 270 top
C12  59.69,92.05 180 top
C13  59.18,89.81 180 top
C14  74.32,64.08 180 top
C15  74.78,51.33 90 top
C16  42.16,49.07 270 top
C17  42.14,43.59 90 top
C18  51.28,43.28 90 top
C19  51.31,47.85 90 top
C20  48.23,39.14 180 top
C21  55.42,45.24 0 top
C22  77.65,31 180 top
C23  95.05,31 0 top
C24  58.8,28.68 0 top
C25  53.47,28.68 0 top
FB1  4.32,82.78 180 top
H2  107.7,93.7 180 top
H3  107.7,4.3 180 top
H4  4.3,4.3 180 top
IC1  15.65,37.86 0 top
IC2  9.78,44.3 90 top
IC3  64.36,43.59 180 top
IC4  35.03,52.73 90 top
IC5  47.24,44.86 90 top
IC6  68.96,58.98 270 top
J1  8.5,17.5 0 top
J2  27,17.5 0 top
J3  48,17.5 0 top
J4  66.5,17.5 0 top
J5  85,17.5 0 top
J6  103.5,17.5 0 top
J7  0.5,50.05 0 top
L1  23.09,49.4 270 top
LED1  8.5,31 270 top
LED2  27,31 270 top
LED3  48,31 270 top
LED4  66.5,31 270 top
LED5  85,31 270 top
LED6  103.5,31 270 top
R1  67.74,52.65 90 top
R2  71.83,52.65 90 top
R3  69.77,52.65 90 top
R4  65.68,52.65 90 top
R5  8.54,28.5 180 top
R6  27,28.55 180 top
R7  48,28.65 180 top
R8  66.5,28.68 180 top
R9  85,28.57 180 top
R10  103.5,28.52 180 top
R11  7.09,37.36 90 top
R12  12.27,37.34 90 top
R13  42.16,39.01 90 top
R14  39.19,47.96 0 top
S1  98,74 180 top
U1  29.57,70 90 top
U$2  [SANWORKS_LOGO]  77.6,35.94 0 top

### Tracks (layer width: path | path; a pad name or v marks a point on that pad's centre or on a via)
3V3  (via drill 0.5, 0.7, 0.8)  (1 unrouted)
  Top 0.6: 6.53,49.64 5.79,48.91 C1.2 | IC2.8 7.87,49.23 7.01,50.09
  Top 0.61: IC6.1 73.41,64.07 C14.2 73.42,65.14 73.41,65.15
  Top 0.8: 5.87,48.95 5.87,48.32 C1.2 | 63.16,89.7 C2.1 63.16,94.98 J7.P$19
  Top 1.2: v9.09,53.52 9.09,52.17 7.01,50.09 5.87,48.95 | U1.3.3V3 37.19,63.4 40.92,67.13 v66.47,67.13 | v72.35,67.17 73.41,67.17 73.41,65.15
  Top 1.5: v63.17,89.69 63.16,89.7
  Bottom 1.2: U1.3.3V3 37.19,61.77 35.2,59.79 15.37,59.79 v9.09,53.52 | v72.35,67.17 66.51,67.17 v66.47,67.13
  Bottom 1.5: S1.V1 106.29,71.46 100.53,77.22 S1.H1 100.56,85.98 96.85,89.69 v63.17,89.69 58.7,89.69 55.09,86.08 43.28,86.08 37.62,80.42 8.26,80.42 6.71,78.87 U1.3.3V
3V3_ISO  (via drill 0.3, 0.5, 0.8)
  Top 0.28: v43.69,45.59 43.92,45.36 IC5.10 | IC5.12 45.32,44.36
  Top 0.305: 44.81,55.78 44.88,55.85 | 45.32,44.36 44.81,43.84 44.35,43.84 43.69,44.5 v43.69,45.59
  Top 0.35: IC3.14 60.55,46.51 | IC3.5 70.1,42.62 73.28,45.8 v73.27,45.81 | IC3.11 68.15,46.51 68.48,46.84 68.48,47.68 67.36,48.79 v66.42,48.79 | 59.7,48.79 59.55,48.95
  Top 0.508: v44.81,54.08 44.81,55.78 | v66.42,48.79 59.7,48.79 | 60.55,46.51 59.55,47.51 C3.2
  Top 0.61: IC4.5 34.08,54.7 | C11.1 39.41,55.81 39.45,55.85
  Top 0.813: 34.08,54.7 35.19,55.81 C11.1 | 74.33,54.93 73.41,55.85 IC6.16 | 58.57,54.69 58.5,54.62 | C3.2 59.55,48.95 59.55,50.48 59.44,50.59
  Top 1: 57.42,55.81 57.44,55.81 | 74.33,54.93 v74.79,54.93 74.79,52.25 C15.2
  Top 1.5: 57.44,55.81 58.57,54.69 58.8,54.91 v61.65,54.91 | 58.5,54.62 59.44,53.69 59.44,50.59 C4.2 | 39.45,55.85 44.88,55.85 57.38,55.85 57.42,55.81
  Bottom 0.508: v73.27,45.81 70.28,48.79 v66.42,48.79 | v44.81,54.08 43.69,52.96 v43.69,45.59
  Bottom 0.813: v74.79,54.93 74.79,54.91
  Bottom 1.5: 74.79,54.91 v61.65,54.91
5V  (via drill 0.8)
  Top 1: 3.15,82.78 FB1.2
  Top 1.5: L1.1 C9.1 v19.61,53.29 | U1.VIN 1.63,81.25 3.15,82.78
  Route15 1: 1.57,77.62 1.57,76.1
  pour Route15: 12.85,63.16 12.88,63.1 12.88,49.2 20.83,49.2 20.83,63.27 9.63,74.47 5.6,74.47 5.54,74.5 2.72,77.32 2.69,77.38 2.69,78.13 0.79,78.13 0.79,75.23
+12V  (via drill 0.7)
  Top 0.28: IC5.1 49.02,43.36
  Top 0.305: 49.17,43.28 49.1,43.28 49.02,43.36
  Top 0.356: IC3.24 60.58,40.01
  Top 0.381: 60.58,40.01 C8.1
  Top 0.508: 49.17,43.28 50.07,42.38 C18.1
  Top 0.8: C8.1 57.38,39.46 C7.1
  Top 0.813: C18.1 50.82,42.38 49.63,41.2 C20.1
  Top 1.2: v55.22,39.12 57.24,39.12 C7.1 | v51.31,39.12 49.66,39.12 C20.1
  Bottom 1.2: v55.22,39.12 v51.31,39.12
+15V
  Top 0.61: C10.1 IC4.1
  Top 1: C10.1 33.43,47.87 IC1.+VOUT 33.43,40.94 36.28,38.09 R13.1
-12V  (via drill 0.6)
  Top 0.28: IC5.7 49.1,46.36
  Top 0.305: 49.25,46.38 49.12,46.38 49.1,46.36
  Top 0.381: C6.1 70.33,40.01 IC3.1 64.52,40.01 64.39,40.03 | 64.39,43.46 IC3.25
  Top 0.508: 49.25,46.38 49.82,46.95 C19.1
  Top 0.762: C6.1 69.34,39.75
  Top 0.813: C19.1 52.31,46.95 C21.1
  Top 1.016: C5.1 71.05,38.91 70.36,39.75 69.34,39.75
  Top 1.2: v74.14,38.71 71.96,38.71 C5.1 | v53.89,43.32 53.89,45.1 C21.1
  Top 2.032: 64.39,40.03 64.39,43.46
  Bottom 1.2: v74.14,38.71 58.32,38.71 53.8,43.23 v53.89,43.32
  pour Top: 60.17,34.44 69.06,34.44 65.81,38.19 65.79,38.22 65.79,38.22 65.78,38.23 65.77,38.26 65.76,38.29 65.76,38.29 65.76,38.3 65.76,38.33 65.76,41.3 62.97,41.3 62.97,38.33 62.97,38.31 62.97,38.29 62.97,38.28 62.96,38.26 62.95,38.23 62.94,38.22 62.94,38.21 62.92,38.19
-15V
  Top 1: IC1.-VOUT 38.28,43.17 R14.1
CS1
  Top 1: J7.P$4 24.99,78.12 U1.17/A3
D/C
  Top 1: U1.37/A18 49.89,77.92 50.52,78.56 50.52,91.39 52.12,92.99 55.95,92.99 J7.P$17
D_LDAC
  Top 0.813: IC6.6 67.06,63.93 65.81,65.18 52.22,65.18 49.89,62.84 U1.28
D_SCK
  Top 0.813: IC6.4 69.6,69.11 66.85,71.86 39.19,71.86 34.65,76.4 U1.13
D_SDA
  Top 0.813: U1.11 32.11,62.48 39.37,69.75 66.6,69.75 68.33,68.02 IC6.5
D_SYNC
  Top 0.813: IC6.3 70.87,70.28 67.54,73.61 60.07,73.61 57.51,76.17 U1.34/A15
GND  (via drill 0.35, 0.45, 0.5, 0.6, 0.7, 0.8, 0.9)
  Top 0.6: IC2.5 11.68,48.49 | v5.77,45.34 5.79,45.37 C1.1
  Top 0.61: IC6.7 65.79,63.2 65.33,63.65 64.52,63.65
  Top 0.7: 11.68,48.49 v11.67,48.5
  Top 0.8: C2.2 65.63,92.59 J7.P$20 | C12.2 58.78,92.06 v57.72,92.06
  Top 0.813: IC6.8 64.52,63.65 v64.49,63.65 | v72.12,63.72 72.14,63.7 IC6.2 | C14.1 75.22,62.75 v75.51,62.46
  Top 1: R10.2 102.02,28.6 | 83.52,28.65 R9.2 | R8.2 65.05,28.63 | 63.2,28.63 v63.17,28.65 | R6.2 25.57,28.57 | 5.16,28.5 v5.13,28.52 | 23.9,28.55 v23.88,28.57 | R7.2 46.47,28.52
  Top 1.2: v81.79,28.65 83.52,28.65 | 65.05,28.63 63.2,28.63 | R6.2 23.9,28.55 | R5.2 5.16,28.5 | v56.21,89.81 C13.2 | 102.02,28.6 v99.36,28.6 | 46.47,28.52 v44.76,28.52
  Top 1.5: C9.2 19.61,44.06 IC1.-VIN
  Route2 0.7: v11.67,48.5 11.71,48.54
  Route2 0.813: v64.49,63.65 64.49,63.91 64.47,63.93
  Route2 1: v75.51,62.46 75.44,62.53
  Bottom 1: v23.88,28.57 23.8,28.5 | 5.13,28.5 v5.13,28.52
  Bottom 1.2: 23.93,28.52 v23.88,28.57 | 4.57,28.5 5.13,28.5 | v81.79,28.65 81.84,28.6 | 89.46,28.73 89.59,28.6
  Bottom 1.5: v2.11,42.14 2.16,30.91 4.57,28.5 | v44.76,28.52 23.93,28.52 | 23.8,28.5 5.13,28.5 | v99.36,28.6 89.59,28.6 81.84,28.6 | v63.17,28.65 v81.79,28.65 | v90.78,64.06 89.46,62.74 89.46,28.73
  pour Route2: 0.99,41.34 27.86,41.34 27.86,60.72 27.86,60.72 27.86,60.76 27.86,60.8 27.86,60.8 27.86,60.8 27.88,60.84 27.89,60.88 27.9,60.88 27.9,60.88 27.92,60.91 27.95,60.93 27.95,60.93 27.95,60.93 27.99,60.95 28.03,60.96 28.03,60.96 28.03,60.96 28.07,60.96 28.11,60.96 28.11,60.96 110.57,60.55 110.57,87.7 101.49,96.78 7.84,96.81 0.99,89.96
GND_ISO  (via drill 0.35, 0.4, 0.5, 0.6)  (1 unrouted)
  Top 0.28: IC5.5 49.36,45.36 v49.58,45.14 49.3,44.86 IC5.4 48.03,44.86 IC5.15
  Top 0.356: IC3.15 59.69,45.87 v59.38,46.18
  Top 0.381: v60.17,42.32 60.17,42.62 IC3.20 60.2,42.62 60.2,41.96 IC3.21 | IC3.19 60.15,43.26 v60.15,43.59 60.15,43.92 IC3.18
  Top 0.61: IC6.9 64.52,55.75 63.63,54.86 v63.63,53.23 | C10.2 35.88,49.66 | 35.88,49.66 35.03,50.51 IC4.2 | v38.2,52.48 C11.2 | v73.56,53.25 73.56,53.92 72.14,55.35 IC6.15 | 35.88,49.66 35.99,49.66 v36.47,50.14 | v59.72,27.3 59.7,27.95 C24.2 | C25.2 54.36,28.67 v54.36,27.38 | C23.2 97.06,31 v97.08,31.01 | C22.2 75.73,31 75.68,31.05 v75.63,31
  Top 0.762: C8.2 59.56,36.83 v59.56,36.68 | C7.2 57.28,36.5 v57.28,34.8 | v71.81,34.29 C5.2 | v69.32,36.58 69.29,36.6 C6.2 | C3.1 56.62,48.03 v56.59,48.01 | C4.1 v54.89,50.57
  Top 0.813: C15.1 v74.78,49.15 | C20.2 46.84,40.97 v46.83,40.98 | C21.2 v56.82,43.49 v56.82,43.48
  Top 1: IC1.COM 35.97,48.42 C10.2 | C17.2 v40.01,44.99 v40.01,44.98 | C16.1 42.14,50.49 v40.37,50.49
  Route2 0.813: 74.55,49.89 74.55,49.28 74.68,49.15 v74.78,49.15
  Bottom 0.381: v60.15,43.59 60.12,43.59
  other vias: 59.49,44.7 58.95,43.13 53.47,50.57 73.33,49.15 74.78,47.73 76.25,49.15 62.18,53.19 63.65,51.59 55.5,43.36 48.23,41.02 45.39,41.07 52.93,42.24 54.89,48.08 39.6,52.5 40.03,46.28 37.36,51.61 56.11,34.44 58.55,34.39 59.56,35.36 69.82,35.26 70.61,33.73 73.25,34.26 71.81,32.72 57.28,33.43 109.7,56.03 109.58,44.96 109.63,33.12 108.03,17.48 33.22,56.16 33.27,37.74 30.73,36.12 2.11,16.31 15.14,36.3 10.67,2.24 32.13,2.29 56.39,2.41 79.68,2.34 100.76,2.39 77.39,56.29 83.26,56.34 92,56.34 101.04,56.39 62.87,56.57 46.94,53.8 54.15,53.85 73.41,51.82 94.23,17.4 75.69,17.48 57.23,17.5 37.54,17.58 17.68,17.65 34.75,41.68 37.21,41.66 35.97,40.79 50.55,15.49 52.5,17.45 50.57,19.56 69.04,15.47 70.99,17.48 69.04,19.56 87.53,15.47 89.48,17.45 87.55,19.53 106.07,15.47 106.05,19.51
  pour Route2 (isolate 0.254): 32.65,36.75 32.53,36.69 32.4,36.65 1.68,36.65 1.68,10.57 10.37,1.88 101.67,1.88 110.21,10.42 110.21,56.87 32.84,56.87 32.84,37.09 32.81,36.96 32.74,36.85
  pour Route2 (isolate 0.254): 32.65,36.75 32.53,36.69 32.4,36.65 1.68,36.65 1.68,10.57 10.37,1.88 101.67,1.88 110.21,10.42 110.21,56.87 32.84,56.87 32.84,37.09 32.81,36.96 32.74,36.85
  pour Route2 (isolate 0.254): 32.4,37.12 32.38,37.1 32.35,37.09 1.24,37.09 1.24,10.39 10.19,1.45 101.85,1.45 110.64,10.24 110.64,57.3 32.41,57.3 32.41,37.15
  pour Route2 (isolate 0.254): 32.65,36.75 32.53,36.69 32.4,36.65 1.68,36.65 1.68,10.57 10.37,1.88 101.67,1.88 110.21,10.42 110.21,56.87 32.84,56.87 32.84,37.09 32.81,36.96 32.74,36.85
  pour Route15 (isolate 0.254): 32.42,37.14 32.4,37.12 32.37,37.11 1.27,37.11 1.27,10.42 10.22,1.47 101.87,1.47 110.67,10.27 110.67,57.33 32.43,57.33 32.43,37.17
LDAC
  Top 0.356: 68.35,45.87 IC3.10
  Top 0.381: 68.35,45.87 69.16,46.63 69.16,48.01 65.68,51.49 R4.1
LED1  (via drill 0.6)
  Top 1: v5.11,31.01 6.74,31.01 LED1.A
  Bottom 1: U1.1 6.71,49.84 4.24,47.37 4.24,31.88 v5.11,31.01
LED2
  Top 1: U1.4 14.33,40.66 23.91,31.51 24.74,31.51 LED2.A
LED3
  Top 1: LED3.A 42.6,34.65 24.33,34.65 16.46,42.52 16.46,55.83 20.14,59.51 38.46,59.51 39.73,60.78 U1.24
LED4  (via drill 0.7)
  Top 1: v62,30.91 64.16,30.91 LED4.A
  Bottom 1: v62,30.91 72.31,30.91 85.24,43.84 85.24,60.45 70.23,75.46 61.37,75.46 59.92,74.02 59.92,62.51 U1.32/A13
LED5  (via drill 0.7)
  Top 1: v81.46,31.01 82.24,31.01 LED5.A
  Bottom 1: v81.46,31.01 87.4,36.96 87.4,61.32 71.07,77.65 60.07,77.65 U1.33/A14
LED6
  Top 1: U1.35/A16 54.97,78.66 56.54,80.24 76.3,80.24 85.72,70.81 85.72,66.02 101.78,49.96 101.78,31.03 LED6.A
MOSI1  (via drill 0.7)
  Top 0.35: 46.08,75.39 46.08,78.92
  Top 0.4: 46.08,78.92 46.1,78.94
  Top 1: v44.86,74.17 46.08,75.39 | J7.P$13 46.1,93.3 46.1,78.94
  Bottom 1: v44.86,74.17 44.86,62.43 U1.26
N$1
  Top 0.6: IC2.1 7.87,39.55 R11.2
N$2
  Top 0.65: R11.1 4.55,35.96 2.06,33.47 2.06,23.94 J1.SIG
N$3
  Top 0.6: IC2.4 11.68,39.32 R12.2
N$4
  Top 0.65: J2.SIG 16.82,27.18 16.82,31.39 R12.1
N$5
  Top 0.65: J1.GND 3.63,24.91 3.63,32.11 5.18,33.66 8,33.66 9.14,34.8 IC2.2
N$6
  Top 0.65: J2.GND 29.04,16.16 27.66,14.78 26.11,14.78 14.53,26.36 14.53,30.4 10.41,34.52 IC2.3
N$7
  Top 1: LED1.C 10.25,28.8 R5.1
N$8
  Top 1: R6.1 28.71,28.86 28.75,29.02 LED2.C
N$9
  Top 0.356: IC3.3 68.5,41.3
  Top 0.381: 68.5,41.3 68.76,41.05
  Top 0.5: 68.76,41.05 74.27,41.05 78.56,36.75 78.56,31.01 C22.1 78.55,23.04 78.56,23.03 84.97,17.53 J5.SIG
N$10
  Top 0.381: IC3.4 69.04,41.96
  Top 0.5: 69.04,41.96 85.72,41.96 94.15,33.54 C23.1 94.15,26.94 94.13,26.92 103.5,17.56 J6.SIG
N$11
  Top 0.381: IC3.23 59,40.66 58.6,41.07
  Top 0.5: 58.6,41.07 54.81,41.07 53.75,40.01 53.75,35.38 57.9,31.23 C24.1 57.9,26.1 J4.SIG
N$12
  Top 0.356: 59.66,41.3 IC3.22
  Top 0.381: 58.9,42.06 59.66,41.3
  Top 0.5: J3.SIG 48,23.03 52.57,27.6 C25.1 52.57,40.27 52.55,40.28 54.33,42.06 58.9,42.06
N$13
  Top 0.61: IC6.14 70.87,54.79 71.83,53.82 R2.2
N$14
  Top 0.61: IC6.13 69.6,53.75 R3.2
N$15
  Top 1.5: L1.2 23.09,43.12 IC1.+VIN
N$16
  Top 0.28: 44.93,45.97 44.96,45.97 45.08,45.86 IC5.9 47.1,45.86 IC5.16 47.39,45.86 IC5.6
  Top 0.508: 44.93,45.97 43.16,47.75 42.09,47.75
  Top 1: R14.2 41.88,47.95 42.09,47.75 C16.2
N$17
  Top 0.61: IC6.12 68.33,54.43 67.74,53.85 R1.2
N$18
  Top 0.61: IC6.11 67.06,55.22 65.68,53.85 R4.2
N$19
  Top 1: LED3.C 49.75,29 R7.1
N$20
  Top 1: LED4.C 68.25,29.11 68.22,29 R8.1
N$21
  Top 1: R9.1 86.75,28.93 LED5.C
N$22
  Top 1: R10.1 105.25,28.87 LED6.C
N$23
  Top 0.28: IC5.14 45.29,43.36
  Top 0.305: 45.29,43.36 45.21,43.28
  Top 0.508: 45.21,43.28 44.09,42.16 42.16,42.16
  Top 1: R13.2 42.16,42.16 C17.1
N$24
  Top 0.28: IC5.3 49.19,44.36 49.25,44.3
  Top 0.305: 51.11,44.36 C18.2
  Top 0.406: 49.25,44.3 51.05,44.3 51.11,44.36
N$25  (via drill 0.8)
  Top 0.8: C13.1 60.59,89.82 C12.1 60.59,95.01 J7.P$18
  Top 1.016: FB1.1 5.84,82.78
  Top 1.5: v52.76,89.61 54.97,87.4 59.08,87.4 60.58,89.33 C13.1 | v23.01,82.83 5.89,82.83 5.84,82.78
  Bottom 1.5: v23.01,82.83 36.17,82.83 42.95,89.61 v52.76,89.61
N$26  (via drill 0.3)
  Top 0.28: v44.63,44.6 44.88,44.86 IC5.11
  Top 0.508: v45.01,47.24 46.52,48.75 C19.2
  Bottom 0.508: v45.01,47.24 44.63,46.86 v44.63,44.6
NAV_B
  Top 1: S1.B1A 100.24,61.3 97.66,63.88 97.66,68.48 91.8,74.35 85.67,74.35 78.03,81.99 55.4,81.99 52.43,79.02 U1.36/A17
NAV_H  (via drill 0.6)
  Top 1: S1.H2 98,85.06 96.02,87.05 80.8,87.05 79.3,85.55 54.25,85.55 52.2,83.49 v52.2,83.44
  Bottom 1: v52.2,83.44 44.02,83.44 39.73,79.15 U1.A22
NAV_V  (via drill 0.6)
  Top 1: S1.V2 101.13,74 91.42,83.72 54.84,83.72 52.91,81.79 v52.78,81.79
  Bottom 1: v52.78,81.79 45.29,81.79 42.27,78.77 U1.A21
RST
  Top 1: J7.P$5 27.53,78.12 U1.16/A2
SCK0
  Top 0.356: IC3.8 69.16,44.55
  Top 0.381: 69.16,44.55 70.87,46.25 70.87,50.64 R3.1
SCK1  (via drill 0.7)
  Top 0.35: 48.62,75.44 48.62,78.94
  Top 1: v47.37,74.19 48.62,75.44 | 48.62,78.94 48.62,93.28 J7.P$14
  Bottom 1: v47.37,74.19 47.37,62.41 U1.27
SDA0
  Top 0.356: IC3.9 68.68,45.21
  Top 0.381: 68.68,45.21 69.9,46.38 69.9,49.58 R1.1
SYNC
  Top 0.356: IC3.7 69.77,43.92 71.83,45.97 R2.1
TRIG1
  Top 0.6: IC2.7 9.14,50.04 10.67,51.56 10.67,54.81 9.22,56.26 9.22,62.35 U1.2
TRIG2
  Top 0.6: IC2.6 10.41,49.55 11.79,50.93 U1.3

### Text on the board
tPlace: J7 | OLED Display | **Requires Display Mod: Jumper Option 1** | Teensy 4.1 | Thumb Joystick | * | * | * | Pulse Pal | * | * | * | rev3.0.1 | * | * | 3 | * | Open Source Pulse Train Generator